# Altium schematic sheet 2331new.SchDoc
size A4
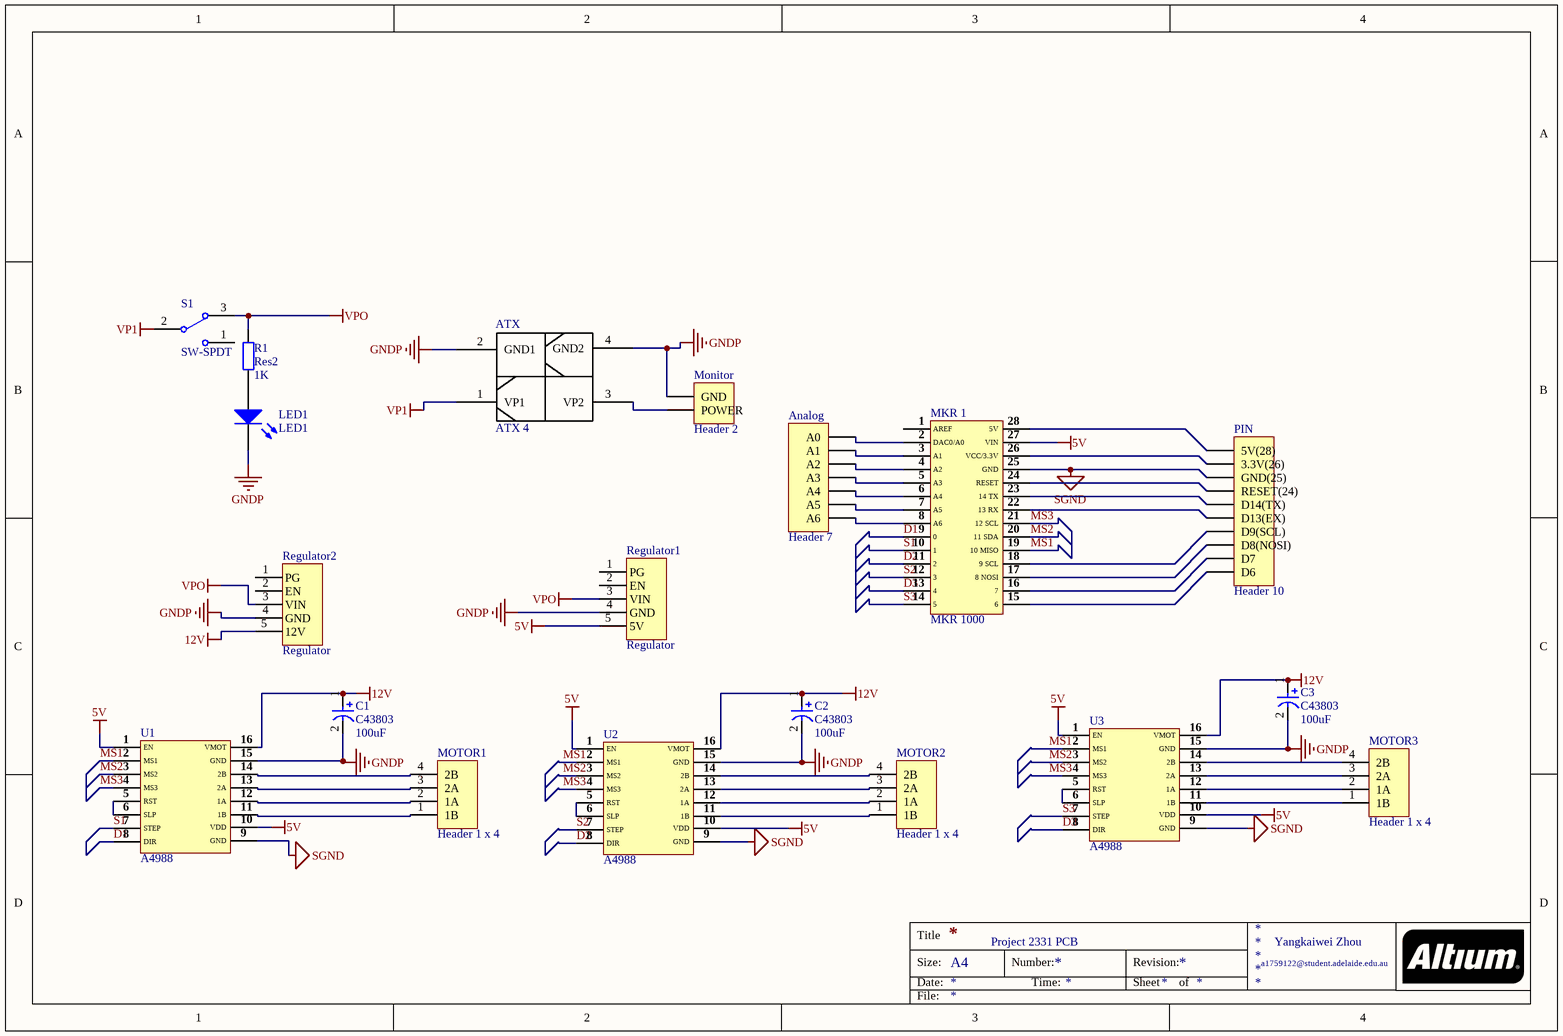
[diagram p0: 2331new.SchDoc]

## Parts
Analog  Header 7  [HDR1X7]
ATX  ATX 4  [ATX4]
C1  C43803  value 100uF  [C43803]
C2  C43803  value 100uF  [C43803]
C3  C43803  value 100uF  [C43803]
LED1  LED1  [LED]
MKR_1  MKR 1000  [MKR1000]
Monitor  Header 2  [HDR1X2]
MOTOR1  Header 1 x 4  [HDR1X4]
MOTOR2  Header 1 x 4  [HDR1X4]
MOTOR3  Header 1 x 4  [HDR1X4]
PIN  Header 10  [HDR1X10]
R1  Res2  value 1K  [AXIAL-0.4]
Regulator1  Regulator  [HDR1X5]
Regulator2  Regulator  [HDR1X5]
S1  SW-SPDT  [SPDT]
U1  A4988  [A4988 Driver]
U2  A4988  [A4988 Driver]
U3  A4988  [A4988 Driver]

## Nets
5V: MKR_1.27(VIN) Regulator1.5(5V) U1.1(EN) U1.10(VDD) U2.1(EN) U2.10(VDD) U3.1(EN) U3.10(VDD)
12V: C1.1 C2.1 C3.1 Regulator2.5(12V) U1.16(VMOT) U2.16(VMOT) U3.16(VMOT)
GNDP: ATX.2(GND1) ATX.4(GND2) C1.2 C2.2 C3.2 LED1.2(K) Monitor.1(GND) Regulator1.4(GND) Regulator2.4(GND) U1.15(GND) U2.15(GND) U3.15(GND)
SGND: MKR_1.25(GND) PIN.3(GND(25)) U1.9(GND) U2.9(GND) U3.9(GND)
VP1: ATX.1(VP1) S1.2
VPO: R1.2 Regulator1.3(VIN) Regulator2.3(VIN) S1.3
D1: MKR_1.9(0) U1.8(DIR)
D2: MKR_1.11(2) U2.8(DIR)
D3: MKR_1.13(4) U3.8(DIR)
MS1: MKR_1.19(10_MISO) U1.2(MS1) U2.2(MS1) U3.2(MS1)
MS2: MKR_1.20(11_SDA) U1.3(MS2) U2.3(MS2) U3.3(MS2)
MS3: MKR_1.21(12_SCL) U1.4(MS3) U2.4(MS3) U3.4(MS3)
S1: MKR_1.10(1) U1.7(STEP)
S2: MKR_1.12(3) U2.7(STEP)
S3: MKR_1.14(5) U3.7(STEP)
NetAnalog_1: Analog.1(A6) MKR_1.8(A6)
NetAnalog_2: Analog.2(A5) MKR_1.7(A5)
NetAnalog_3: Analog.3(A4) MKR_1.6(A4)
NetAnalog_4: Analog.4(A3) MKR_1.5(A3)
NetAnalog_5: Analog.5(A2) MKR_1.4(A2)
NetAnalog_6: Analog.6(A1) MKR_1.3(A1)
NetAnalog_7: Analog.7(A0) MKR_1.2(DAC0/A0)
NetATX_3: ATX.3(VP2) Monitor.2(POWER)
NetLED1_1: LED1.1(A) R1.1
NetMKR_1_15: MKR_1.15(6) PIN.10(D6)
NetMKR_1_16: MKR_1.16(7) PIN.9(D7)
NetMKR_1_17: MKR_1.17(8_NOSI) PIN.8(D8(NOSI))
NetMKR_1_18: MKR_1.18(9_SCL) PIN.7(D9(SCL))
NetMKR_1_22: MKR_1.22(13_RX) PIN.6(D13(EX))
NetMKR_1_23: MKR_1.23(14_TX) PIN.5(D14(TX))
NetMKR_1_24: MKR_1.24(RESET) PIN.4(RESET(24))
NetMKR_1_26: MKR_1.26(VCC/3.3V) PIN.2(3.3V(26))
NetMKR_1_28: MKR_1.28(5V) PIN.1(5V(28))
NetMOTOR1_1: MOTOR1.1(1B) U1.11(1B)
NetMOTOR1_2: MOTOR1.2(1A) U1.12(1A)
NetMOTOR1_3: MOTOR1.3(2A) U1.13(2A)
NetMOTOR1_4: MOTOR1.4(2B) U1.14(2B)
NetMOTOR2_1: MOTOR2.1(1B) U2.11(1B)
NetMOTOR2_2: MOTOR2.2(1A) U2.12(1A)
NetMOTOR2_3: MOTOR2.3(2A) U2.13(2A)
NetMOTOR2_4: MOTOR2.4(2B) U2.14(2B)
NetMOTOR3_1: MOTOR3.1(1B) U3.11(1B)
NetMOTOR3_2: MOTOR3.2(1A) U3.12(1A)
NetMOTOR3_3: MOTOR3.3(2A) U3.13(2A)
NetMOTOR3_4: MOTOR3.4(2B) U3.14(2B)
NetU1_5: U1.5(RST) U1.6(SLP)
NetU2_5: U2.5(RST) U2.6(SLP)
NetU3_5: U3.5(RST) U3.6(SLP)

Not connected (* = marked no-connect by the designer): MKR_1 1(AREF); Regulator1 1(PG) 2(EN); Regulator2 1(PG) 2(EN); S1 1

## Notes on the sheet
- Project 2331 PCB
- a1759122@student.adelaide.edu.au
- Yangkaiwei Zhou
- Title
- Size:
- Date:
- A4
- Number:
- Time:
- Revision:
- Sheet
- of
- File:

## Library data of the parts
Analog = Header 7: Header, 7-Pin; LatestRevisionDate: 17-Jul-2002; LatestRevisionNote: Re-released for DXP Platform.; Publisher: Altium Limited
ATX = ATX 4: ATX 4Pins power connector
C1-C3 = C43803: Polarized Capacitor C43803 100uF; Published: 8-Jun-2000; LatestRevisionDate: 29-May-2009; LatestRevisionNote: IPC-7351 Footprint Added.; PackageReference: C0805; Publisher: Altium Limited; PackageDescription: Chip Capacitor
LED1 = LED1: Typical RED GaAs LED; Published: 8-Jun-2000; LatestRevisionDate: 08-Jul-2005; LatestRevisionNote: Mech Layer 1 removed.; PackageReference: LED-1; Publisher: Altium Limited; PackageDescription: LED; 2 Leads
MKR_1 = Arduino MKR 1000: Arduino wifi
Monitor = Header 2: Header, 2-Pin; LatestRevisionDate: 17-Jul-2002; LatestRevisionNote: Re-released for DXP Platform.; Publisher: Altium Limited
MOTOR1-MOTOR3 = Header 1 x 4: Header, 4-Pin; LatestRevisionDate: 17-Jul-2002; LatestRevisionNote: Re-released for DXP Platform.; Publisher: Altium Limited
PIN = Header 10: Header, 10-Pin; LatestRevisionDate: 17-Jul-2002; LatestRevisionNote: Re-released for DXP Platform.; Publisher: Altium Limited
R1 = Res2: Resistor; Published: 8-Jun-2000; LatestRevisionDate: 17-Jul-2002; LatestRevisionNote: Re-released for DXP Platform.; PackageReference: AXIAL-0.4; Publisher: Altium Limited; PackageDescription: Axial Device, Thru-Hole; 2 Leads; 0.4 in Pin Spacing
Regulator1 Regulator2 = Header1x5: Voltage Regulator D24V25F5; LatestRevisionDate: 17-Jul-2002; LatestRevisionNote: Re-released for DXP Platform.; Publisher: Altium Limited
S1 = SW-SPDT: SPDT Subminiature Toggle Switch, Right Angle Mounting, Vertical Actuation; Published: 24-Mar-1999; LatestRevisionDate: 17-Dec-2003; LatestRevisionNote: Schematic revised, PCB Footprint replaced.; DatasheetVersion: 05-Dec-2000; PackageReference: TL36WW15050; Publisher: Altium Limited; PackageDescription: Switch; 4 Leads; ComponentLink1Description: Manufacturer Link; ComponentLink1URL: http://www.apem.com
U1-U3 = A4988 Driver: Motor Driver